# Altium schematic sheet Power.SchDoc
size A
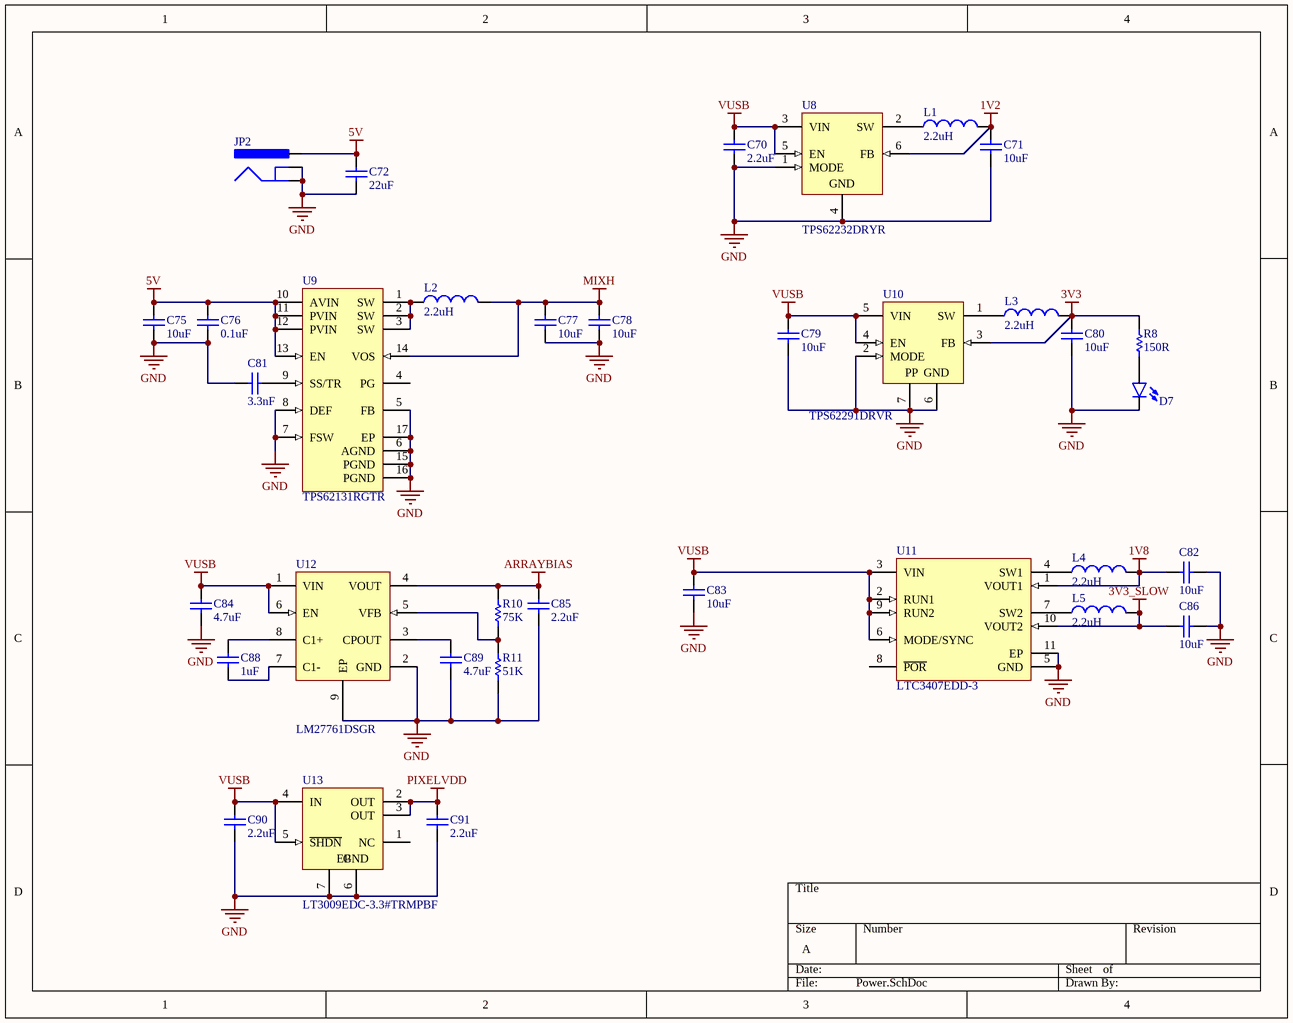
[diagram p0: Power.SchDoc]

## Parts
C70  value 2.2uF  [C0402[1005X55]]  (hidden comment: 2.2uF 6.3V 0402)
C71  value 10uF  [C0402[1005X55]]  (hidden comment: 10uF 6.3V 0402)
C72  value 22uF  [C0603[1608X92]]  (hidden comment: 22uF 6.3V 0603)
C75  value 10uF  [C0402[1005X55]]  (hidden comment: 10uF 6.3V 0402)
C76  value 0.1uF  [C0402[1005X55]]  (hidden comment: 0.1uF 6.3V 0402)
C77  value 10uF  [C0402[1005X55]]  (hidden comment: 10uF 6.3V 0402)
C78  value 10uF  [C0402[1005X55]]  (hidden comment: 10uF 6.3V 0402)
C79  value 10uF  [C0402[1005X55]]  (hidden comment: 10uF 6.3V 0402)
C80  value 10uF  [C0402[1005X55]]  (hidden comment: 10uF 6.3V 0402)
C81  value 3.3nF  [C0402[1005X55]]  (hidden comment: 3.3nF 50V 0402)
C82  value 10uF  [C0402[1005X55]]  (hidden comment: 10uF 6.3V 0402)
C83  value 10uF  [C0402[1005X55]]  (hidden comment: 10uF 6.3V 0402)
C84  value 4.7uF  [C0402[1005X55]]  (hidden comment: 4.7uF 6.3V 0402)
C85  value 2.2uF  [C0402[1005X55]]  (hidden comment: 2.2uF 6.3V 0402)
C86  value 10uF  [C0402[1005X55]]  (hidden comment: 10uF 6.3V 0402)
C88  value 1uF  [C0402[1005X55]]  (hidden comment: 1uF 6.3V 0402)
C89  value 4.7uF  [C0402[1005X55]]  (hidden comment: 4.7uF 6.3V 0402)
C90  value 2.2uF  [C0402[1005X55]]  (hidden comment: 2.2uF 6.3V 0402)
C91  value 2.2uF  [C0402[1005X55]]  (hidden comment: 2.2uF 6.3V 0402)
D7  LED_0603_BLUE_5mA  [LED0603]  (value not drawn)
JP2  POWER_JACK  [POWER-JACK-2.1X5.5MM-SMD]  (value not drawn)
L1  2.2uH  [IND0603]
L2  2.2uH  [IND1008]
L3  2.2uH  [IND0805]
L4  2.2uH  [IND0603]
L5  2.2uH  [IND0603]
R8  value 150R  [R0402[1005]]  (hidden comment: 150R 1% 0402)
R10  value 75K  [R0402[1005]]  (hidden comment: 75K 1% 0402)
R11  value 51K  [R0402[1005]]  (hidden comment: 51K 1% 0402)
U8  TPS62232DRYR  [DRY0006A]
U9  TPS62131RGTR  [RGT0016C_V]
U10  TPS62291DRVR  [WSON-6]
U11  LTC3407EDD-3  [VSON-10 (3mmx3mm)]
U12  LM27761DSGR  [WSON-8]
U13  LT3009EDC-3.3#TRMPBF  [LT-DC6-6_V]

## Nets
1V2: C71.2 L1.2 U8.6(FB)
1V8: C82.2 L4.2 U11.1(VOUT1)
3V3: C80.2 L3.2 R8.2 U10.3(FB)
3V3_SLOW: C86.1 L5.2 U11.10(VOUT2)
5V: C72.2 C75.2 C76.2 JP2.1(PWR) U9.10(AVIN) U9.11(PVIN) U9.12(PVIN) U9.13(EN)
ARRAYBIAS: C85.2 R10.2 U12.4(VOUT)
GND: C70.1 C71.1 C72.1 C75.1 C76.1 C77.1 C78.1 C79.1 C80.1 C81.1 C82.1 C83.1 C84.1 C85.1 C86.2 C89.1 C90.1 C91.1 D7.C JP2.2(GND) JP2.3(GND) R11.1 U8.1(MODE) U8.4(GND) U9.5(FB) U9.6(AGND) U9.7(FSW) U9.8(DEF) U9.15(PGND) U9.16(PGND) U9.17(EP) U10.2(MODE) U10.6(GND) U10.7(EP) U11.5(GND) U11.11(EP) U12.2(GND) U12.9(EP) U13.6(GND) U13.7(EP)
MIXH: C77.2 C78.2 L2.2 U9.14(VOS)
PIXELVDD: C91.2 U13.2(OUT) U13.3(OUT)
VUSB: C70.2 C79.2 C83.2 C84.2 C90.2 U8.3(VIN) U8.5(EN) U10.4(EN) U10.5(VIN) U11.2(RUN1) U11.3(VIN) U11.6(MODE/SYNC) U11.9(RUN2) U12.1(VIN) U12.6(EN) U13.4(IN) U13.5(~{SHDN})
NetC81_2: C81.2 U9.9(SS/TR)
NetC88_1: C88.1 U12.7(C1-)
NetC88_2: C88.2 U12.8(C1+)
NetC89_2: C89.2 U12.3(CPOUT)
NetD7_A: D7.A R8.1
NetL1_1: L1.1 U8.2(SW)
NetL2_1: L2.1 U9.1(SW) U9.2(SW) U9.3(SW)
NetL3_1: L3.1 U10.1(SW)
NetL4_1: L4.1 U11.4(SW1)
NetL5_1: L5.1 U11.7(SW2)
NetR10_1: R10.1 R11.2 U12.5(VFB)

Not connected (* = marked no-connect by the designer): U9 4(PG); U11 8(~{POR}); U13 1(NC)

## Notes on the sheet
- (in symbol TPS62291DRVR) PP

## Library data of the parts
C70 C85 C90 C91 = CAP_2.2uF_6.3V_0402_20%: 2.2uF 6.3V 20% 0402 (1005 Metric); PartNumber: GRM155R60J225ME15D; Manufacturer: Murata; Mounting Technology: Surface Mount; PackageReference: 0402; PackageDescription: 0402 (1005 Metric); Voltage: 6.3V; Tolerance: 20%
C71 C75 C77-C80 C82 C83 C86 = CAP_10uF_6.3V_0402_20%: 10uF 6.3V 20% 0402 (1005 Metric); PartNumber: GRM155R60J106ME44D; Manufacturer: Murata; Mounting Technology: Surface Mount; PackageReference: 0402; PackageDescription: 0402 (1005 Metric); Voltage: 6.3V; Tolerance: 20%
C72 = CAP_22uF_6.3V_0603_10%: 22uF 6.3V 10% 0603 (1608 Metric); PartNumber: GRT188R60J226ME13D; Manufacturer: Murata; Mounting Technology: Surface Mount; PackageReference: 0603; PackageDescription: 0603 (1608 Metric); Voltage: 6.3V; Tolerance: 10%
C76 = CAP_0.1uF_6.3V_0402_10%: 0.1uF 6.3V 10% 0402 (1005 Metric); PartNumber: GRM155R70J104KA01D; Manufacturer: Murata; Mounting Technology: Surface Mount; PackageReference: 0402; PackageDescription: 0402 (1005 Metric); Voltage: 6.3V; Tolerance: 10%
C81 = CAP_3.3nF_50V_0402_10%: 3.3nF 50V 10% 0402 (1005 Metric); PartNumber: GRM155R71H332KA01D; Manufacturer: Murata; Mounting Technology: Surface Mount; PackageReference: 0402; PackageDescription: 0402 (1005 Metric); Voltage: 50V; Tolerance: 10%
C84 C89 = CAP_4.7uF_6.3V_0402_20%: 4.7uF 6.3V 20% 0402 (1005 Metric); PartNumber: GRM155R60J475ME47D; Manufacturer: Murata; Mounting Technology: Surface Mount; PackageReference: 0402; PackageDescription: 0402 (1005 Metric); Voltage: 6.3V; Tolerance: 20%
C88 = CAP_1uF_6.3V_0402_10%: 1uF 6.3V 10% 0402 (1005 Metric); PartNumber: GRM155R70J105KA12D; Manufacturer: Murata; Mounting Technology: Surface Mount; PackageReference: 0402; PackageDescription: 0402 (1005 Metric); Voltage: 6.3V; Tolerance: 10%
D7 = LED_0603_BLUE_5mA: PartNumber: LTST-C193TBKT-5A; Manufacturer: Lite-On Inc.; PackageReference: 0603; PackageDescription: 0603 (1608 Metric); Mounting Technology: Surface Mount
JP2 = POWER_JACK: Manufacturer: CUI Inc.; PartNumber: PJ-036AH-SMT-TR; Mounting Technology: Surface Mount; PackageReference: 2X5.5MM
L1 L4 L5 = IND_2.2uH_750mA_0603_20%: 2.2uH 20% 750mA 0603; PartNumber: LQM18PZ2R2MCHD; Manufacturer: Murata; PackageReference: 0603; PackageDescription: 0603 (1608 metric); Value: 2.2uH; Mounting Technology: Surface Mount; Current: 750mA
L2 = IND_2.2uH_3.3A_1008_20%: 2.2uH 20% 3.3A 1008; PartNumber: DFE252012F-2R2M=P2; Manufacturer: Murata; PackageReference: 1008; PackageDescription: 1008 (2520 metric); Mounting Technology: Surface Mount; Current: 3.3A; Value: 2.2uH
L3 = IND_2.2uH_1.7A_0805_20%: 2.2uH 20% 1.7A 0805; PartNumber: LQM21PN2R2MGHL; Manufacturer: Murata; PackageReference: 0805; PackageDescription: 0805 (2012 metric); Value: 2.2uH; Mounting Technology: Surface Mount; Current: 1.7A
R8 = RES_150R_0402_1%: 150R 0.063W 1% 0402 (1005 Metric); Manufacturer: KOA Speer; PartNumber: RK73H1ETTP1500F; Tolerance: 1%; Power: 0.063W; Mounting Technology: Surface Mount; PackageReference: 0402; PackageDescription: 0402 (1005 Metric); ComponentLink1Description: Datasheet; ComponentLink1URL: http://www.koaspeer.com/catimages/Products/RK73H/RK73H.pdf
R10 = RES_75K_0402_1%: 75K 0.063W 1% 0402 (1005 Metric); Manufacturer: KOA Speer; PartNumber: RK73H1ETTP7502F; Tolerance: 1%; Power: 0.063W; Mounting Technology: Surface Mount; PackageReference: 0402; PackageDescription: 0402 (1005 Metric); ComponentLink1Description: Datasheet; ComponentLink1URL: http://www.koaspeer.com/catimages/Products/RK73H/RK73H.pdf
R11 = RES_51K_0402_1%: 51K 0.063W 1% 0402 (1005 Metric); Manufacturer: KOA Speer; PartNumber: RK73H1ETTP5102F; Tolerance: 1%; Power: 0.063W; Mounting Technology: Surface Mount; PackageReference: 0402; PackageDescription: 0402 (1005 Metric); ComponentLink1Description: Datasheet; ComponentLink1URL: http://www.koaspeer.com/catimages/Products/RK73H/RK73H.pdf
U8 = CMP-0323-00291-3: Buck Step Down Regulator with 2.05 to 6 V Input and 1.2 V Output, -40 to 85 degC, 6-Pin SON (DRY), Green (RoHS & no Sb/Br); Manufacturer: Texas Instruments; Synchronous Rectification: TRUE; Duty Cycle(Max)(%): 100; Iout(Max)(A): 0.5; Switch Current Limit(Typ)(A): 0.84; Vout(Min)(V): 1.2; Rating: Catalog; Vin(Max)(V): 6; SubFamily: Step-Down Regulator; Vin(Min)(V): 2.05; Iq(Typ)(mA): 0.022; Regulated Outputs(#): 1; ComponentLink1URL: http://www.ti.com/general/docs/lit/getliterature.tsp?genericPartNumber=TPS62232&fileType=pdf; ComponentLink3Description: URL Link1; PackageDescription: 6-Pin Plastic Small Outline No-Lead, 1 x 1.45 x 0.6 mm Body, 0.5 mm Pitch; ComponentLink2URL: http://www.ti.com/litv/pdf/mpds221e; Topology: Buck; DatasheetVersion: SLVS941E; PackageReference: DRY0006A; PartNumber: TPS62232DRYR; ComponentLink2Description: Package Specification; ComponentLink1Description: Datasheet; Preset Vout(V): 1.2; Mounting Technology: Surface Mount; Eco-Plan: Green (RoHS & no Sb/Br); ComponentLink3URL: Samples URL:http://www.ti.com/product/tps62232#samples; Vout(Max)(V): 1.2; PackageVersion: revF, Dec-2011
U9 = CMP-0323-00113-2: Buck Step Down Regulator with 3 to 17 V Input and 1.8 V Output, -40 to 85 degC, 16-Pin QFN (RGT), Green (RoHS & no Sb/Br); Manufacturer: Texas Instruments; Duty Cycle(Max)(%): 100; Vin(Max)(V): 17; Switch Current Limit(Typ)(A): 4.2; Iq(Typ)(mA): 0.017; Preset Vout(V): 1.8; Synchronous Rectification: TRUE; SubFamily: Step-Down Regulator; Regulated Outputs(#): 1; Vin(Min)(V): 3; Rating: Catalog; DatasheetVersion: SLVSAG7; ComponentLink2URL: Samples URL:http://www.ti.com/product/tps62131#samples; Topology: Buck; PackageVersion: revH, Oct-2011; Vout(Max)(V): 1.8; PackageDescription: 16-Pin Plastic Quad Flat No-Lead, 3 x 3 mm Body, 0.5 mm Pitch, 1.7 x 1.7 mm Exposed Pad; ComponentLink2Description: URL Link1; Vout(Min)(V): 1.8; Eco-Plan: Green (RoHS & no Sb/Br); ComponentLink1Description: Datasheet; ComponentLink1URL: http://www.ti.com/general/docs/lit/getliterature.tsp?genericPartNumber=TPS62131&fileType=pdf; PackageReference: RGT0016C; PartNumber: TPS62131RGTR; Iout(Max)(A): 3; Code_JEDEC: MO-220; Mounting Technology: Surface Mount
U10 = TPS62291DRVR: Voltage Regulators - Switching Regulators 2.25MHz 1A Step-Down Cnvrtr 3.3V Output; Manufacturer: Texas Instruments; PartNumber: TPS62291DRVR; PackageReference: WSON-6; PackageDescription: SON, 6-Leads, Body 2x2mm, Pitch 0.65mm, Thermal Pad 1.6x1mm, TI Recommended; Mounting Technology: Surface Mount
U11 = LTC3407EDD-3: Manufacturer: Linear Technology; PartNumber: LTC3407EDD-3; PackageReference: SON-10; Mounting Technology: Surface Mount
U12 = LM27761DSGR: Switching Voltage Regulators Switch Cap Boost; Manufacturer: Texas Instruments; PartNumber: LM27761DSGR; Mounting Technology: Surface Mount; PackageReference: WSON-8
U13 = CMP-0476-00025-3: 3 uA IQ, 20 mA Low Dropout Linear Regulator, 1.6 to 20 V Vin, 3.3 V Vout, 6-pin SON (DC6-6), -40 to 125 degC, Pb-Free, Mini Tape and Reel; Manufacturer: Linear Technology; Vin Max(V): 20; Isupply(mA): 0.003; Discrete Pass Element: no; Vin Min(V): 1.6; Output Voltage: 3.3 V; Dropout Voltage(V): 0.28; PSRR(dB): 61; Number of Outputs: 1; Noise(uV): 150; PackageReference: DC6-6; PackageVersion: Rev. B, 06/2010; ComponentLink3URL: http://cds.linear.com/docs/en/packaging/DFN_6_05-08-1703.pdf; Code_JEDEC: MO-229; Mounting Technology: Surface Mount; ComponentLink2URL: http://cds.linear.com/docs/en/datasheet/3009fd.pdf; Iout(mA): 20; ComponentLink3Description: Package Specification; Packing: Mini Tape and Reel; ComponentLink1URL: http://www.linear.com/; RoHS: TRUE; DatasheetVersion: Rev. D; ComponentLink1Description: Manufacturer URL; PartNumber: LT3009EDC-3.3#TRMPBF; Shutdown Current(uA): 1; PackageDescription: 6-Pin Plastic DFN, Body 2 x 2 mm, Pitch 0.5 mm; ComponentLink2Description: Datasheet